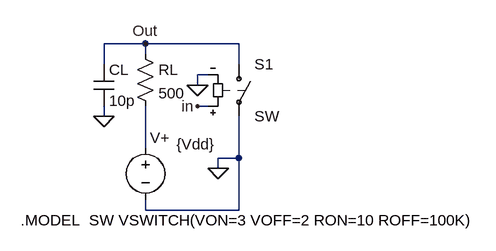
[diagram p0: schematic Inverter.asc]
Inverter.asc, the LTspice schematic file:
Version 4
SHEET 1 880 680
WIRE 48 112 -16 112
WIRE 192 112 48 112
WIRE 48 128 48 112
WIRE -16 144 -16 112
WIRE 192 144 192 112
WIRE 144 160 128 160
WIRE 128 176 128 160
WIRE 144 208 128 208
WIRE -16 224 -16 208
WIRE 48 272 48 208
WIRE 192 288 192 224
WIRE 192 288 160 288
WIRE 160 304 160 288
WIRE 48 368 48 352
WIRE 192 368 192 288
WIRE 192 368 48 368
FLAG 48 112 Out
FLAG -16 224 0
FLAG 128 176 0
FLAG 128 208 in
FLAG 160 304 0
SYMBOL res 32 112 R0
SYMATTR InstName RL
SYMATTR Value 500
SYMBOL cap -32 144 R0
SYMATTR InstName CL
SYMATTR Value 10p
SYMBOL sw 192 128 R0
SYMATTR InstName S1
SYMBOL voltage 48 256 R0
WINDOW 0 7 1 Left 0
WINDOW 3 48 11 Left 0
SYMATTR InstName V+
SYMATTR Value {Vdd}
TEXT -144 384 Left 0 !.MODEL  SW VSWITCH(VON=3 VOFF=2 RON=10 ROFF=100K)

The netlist it stands for:
* Inverter.asc
RL Out N001 500
CL Out 0 10p
S1 Out 0 in 0 SW
V+ N001 0 {Vdd}
.MODEL  SW VSWITCH(VON=3 VOFF=2 RON=10 ROFF=100K)
.backanno
.end